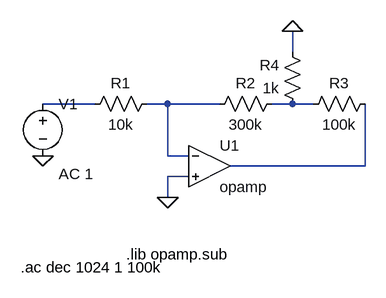
[diagram p0: schematic inversor.asc]
inversor.asc, the LTspice schematic file:
Version 4
SHEET 1 880 680
WIRE 288 -16 288 -48
WIRE -16 64 -96 64
WIRE 96 64 64 64
WIRE 176 64 96 64
WIRE 288 64 256 64
WIRE 320 64 288 64
WIRE 96 144 96 64
WIRE 128 144 96 144
WIRE 400 160 400 64
WIRE 400 160 192 160
WIRE 128 176 96 176
WIRE 96 208 96 176
FLAG 96 208 0
FLAG 288 -48 0
FLAG -96 144 0
SYMBOL OpAmps\\opamp 160 96 R0
SYMATTR InstName U1
SYMBOL res 80 48 R90
WINDOW 0 0 56 VBottom 2
WINDOW 3 32 56 VTop 2
SYMATTR InstName R1
SYMATTR Value 10k
SYMBOL res 272 48 R90
WINDOW 0 0 56 VBottom 2
WINDOW 3 32 56 VTop 2
SYMATTR InstName R2
SYMATTR Value 300k
SYMBOL res 304 80 R270
WINDOW 0 32 56 VTop 2
WINDOW 3 0 56 VBottom 2
SYMATTR InstName R3
SYMATTR Value 100k
SYMBOL res 304 80 R180
WINDOW 0 36 76 Left 2
WINDOW 3 36 40 Left 2
SYMATTR InstName R4
SYMATTR Value 1k
SYMBOL voltage -96 48 R0
WINDOW 123 24 124 Left 2
WINDOW 39 0 0 Left 0
SYMATTR InstName V1
SYMATTR Value ""
SYMATTR Value2 AC 1
TEXT 32 296 Left 2 !.lib opamp.sub
TEXT -130 316 Left 2 !.ac dec 1024 1 100k

The netlist it stands for:
* inversor.asc
XU1 N002 0 N004 opamp Aol=100K GBW=10Meg  ; pins invin noninvin out
R1 N002 N001 10k
R2 N003 N002 300k
R3 N003 N004 100k
R4 N003 0 1k
V1 N001 0 AC 1
.lib opamp.sub
.ac dec 1024 1 100k
.backanno
.end